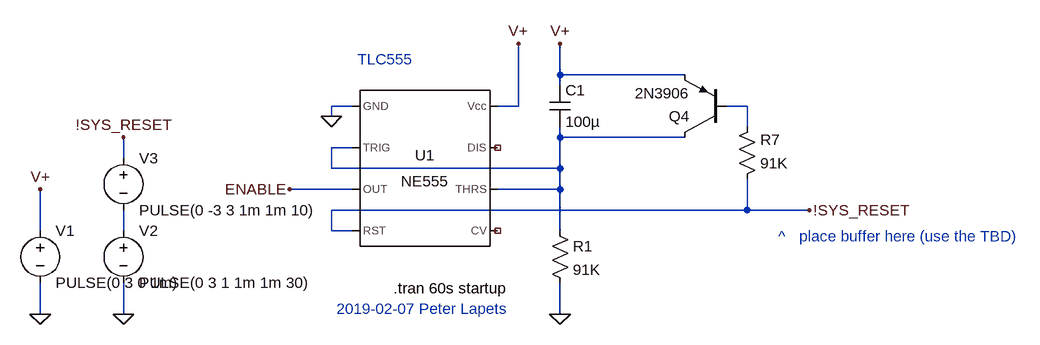
[diagram p0: schematic lockout2_v0.asc]
lockout2_v0.asc, the LTspice schematic file:
Version 4
SHEET 1 1204 680
WIRE 32 -464 32 -512
WIRE 224 -464 32 -464
WIRE 32 -448 32 -464
WIRE -288 -416 -320 -416
WIRE -32 -416 -32 -512
WIRE -32 -416 -64 -416
WIRE 320 -416 288 -416
WIRE -320 -400 -320 -416
WIRE 320 -384 320 -416
WIRE 32 -368 32 -384
WIRE 224 -368 32 -368
WIRE -288 -352 -320 -352
WIRE -640 -336 -640 -368
WIRE -320 -320 -320 -352
WIRE 32 -320 32 -368
WIRE 32 -320 -320 -320
WIRE -288 -288 -384 -288
WIRE 32 -288 32 -320
WIRE 32 -288 -64 -288
WIRE 320 -256 320 -304
WIRE 320 -256 -320 -256
WIRE 416 -256 320 -256
WIRE -768 -224 -768 -288
WIRE -640 -224 -640 -256
WIRE -320 -224 -320 -256
WIRE -288 -224 -320 -224
WIRE 32 -224 32 -288
WIRE -768 -96 -768 -144
WIRE -640 -96 -640 -144
WIRE 32 -96 32 -144
FLAG -768 -96 0
FLAG -768 -288 V+
FLAG -320 -400 0
FLAG -640 -368 !SYS_RESET
FLAG -32 -512 V+
FLAG 416 -256 !SYS_RESET
FLAG 32 -512 V+
FLAG 32 -96 0
FLAG -384 -288 ENABLE
FLAG -640 -96 0
SYMBOL Misc\\NE555 -176 -320 R0
SYMATTR InstName U1
SYMBOL voltage -768 -240 R0
WINDOW 123 0 0 Left 2
WINDOW 39 0 0 Left 2
SYMATTR InstName V1
SYMATTR Value PULSE(0 3 0 1m)
SYMBOL res 16 -240 R0
SYMATTR InstName R1
SYMATTR Value 91K
SYMBOL cap 16 -448 R0
SYMATTR InstName C1
SYMATTR Value 100µ
SYMBOL pnp 288 -368 R180
SYMATTR InstName Q4
SYMATTR Value 2N3906
SYMBOL res 304 -288 M180
WINDOW 0 36 76 Left 2
WINDOW 3 36 40 Left 2
SYMATTR InstName R7
SYMATTR Value 91K
SYMBOL voltage -640 -240 R0
WINDOW 123 0 0 Left 2
WINDOW 39 0 0 Left 2
SYMATTR InstName V2
SYMATTR Value PULSE(0 3 1 1m 1m 30)
SYMBOL voltage -640 -352 R0
WINDOW 123 0 0 Left 2
WINDOW 39 0 0 Left 2
SYMATTR InstName V3
SYMATTR Value PULSE(0 -3 3 1m 1m 10)
TEXT -224 -136 Left 2 !.tran 60s startup
TEXT -312 -104 Left 2 ;2019-02-07 Peter Lapets
TEXT -280 -488 Left 2 ;TLC555
TEXT 368 -216 Left 2 ;^   place buffer here (use the TBD)

The netlist it stands for:
* lockout2_v0.asc
XU1 0 N002 ENABLE !SYS_RESET NC_01 N002 NC_02 V+ NE555  ; pins GND TRIG OUT RST CV THRS DIS Vcc
V1 V+ 0 PULSE(0 3 0 1m)
R1 N002 0 91K
C1 V+ N002 100µ
Q4 N002 N001 V+ 0 2N3906
R7 !SYS_RESET N001 91K
V2 N003 0 PULSE(0 3 1 1m 1m 30)
V3 !SYS_RESET N003 PULSE(0 -3 3 1m 1m 10)
.model NPN NPN
.model PNP PNP
.lib standard.bjt
.tran 60s startup
* 2019-02-07 Peter Lapets
* TLC555
* ^   place buffer here (use the TBD)
.lib NE555.sub
.backanno
.end

* Results of the author's LTspice run, read from the files saved beside the schematic
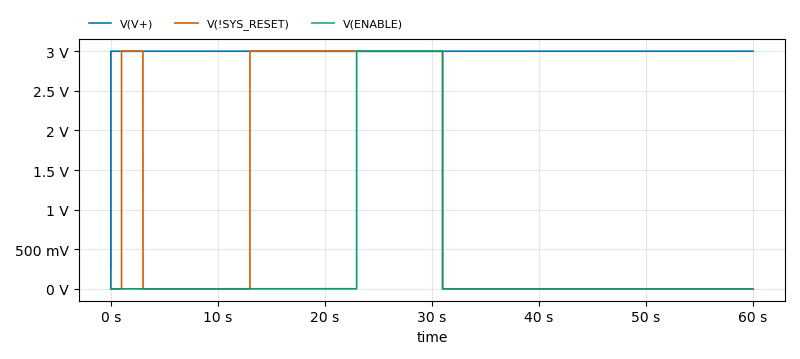
[diagram p1: Transient Analysis of lockout2_v0.asc, plotted from the saved traces]
* Transient Analysis, 1 run:
*   V(V+): min 0 V, max 3 V, average 3 V, rms 3 V, last 3 V
*   V(!SYS_RESET): min 0 V, max 3 V, average 1 V, rms 1.732 V, last 0 V
*   V(ENABLE): min 0 V, max 3 V, average 401.6 mV, rms 1.098 V, last 18 µV